# Altium schematic sheet joystick_if.SchDoc: Chorda Fingers
size Tabloid; CheckedBy: artemd@; Author: dnv@; DrawnBy: dnv; Organization: Altium Limited; Address1: 1600 Amphitheatre Pkwy, Mountain View CA 94043; DocumentNumber: N/A; Revision: 1; SheetNumber: 1; SheetTotal: 1
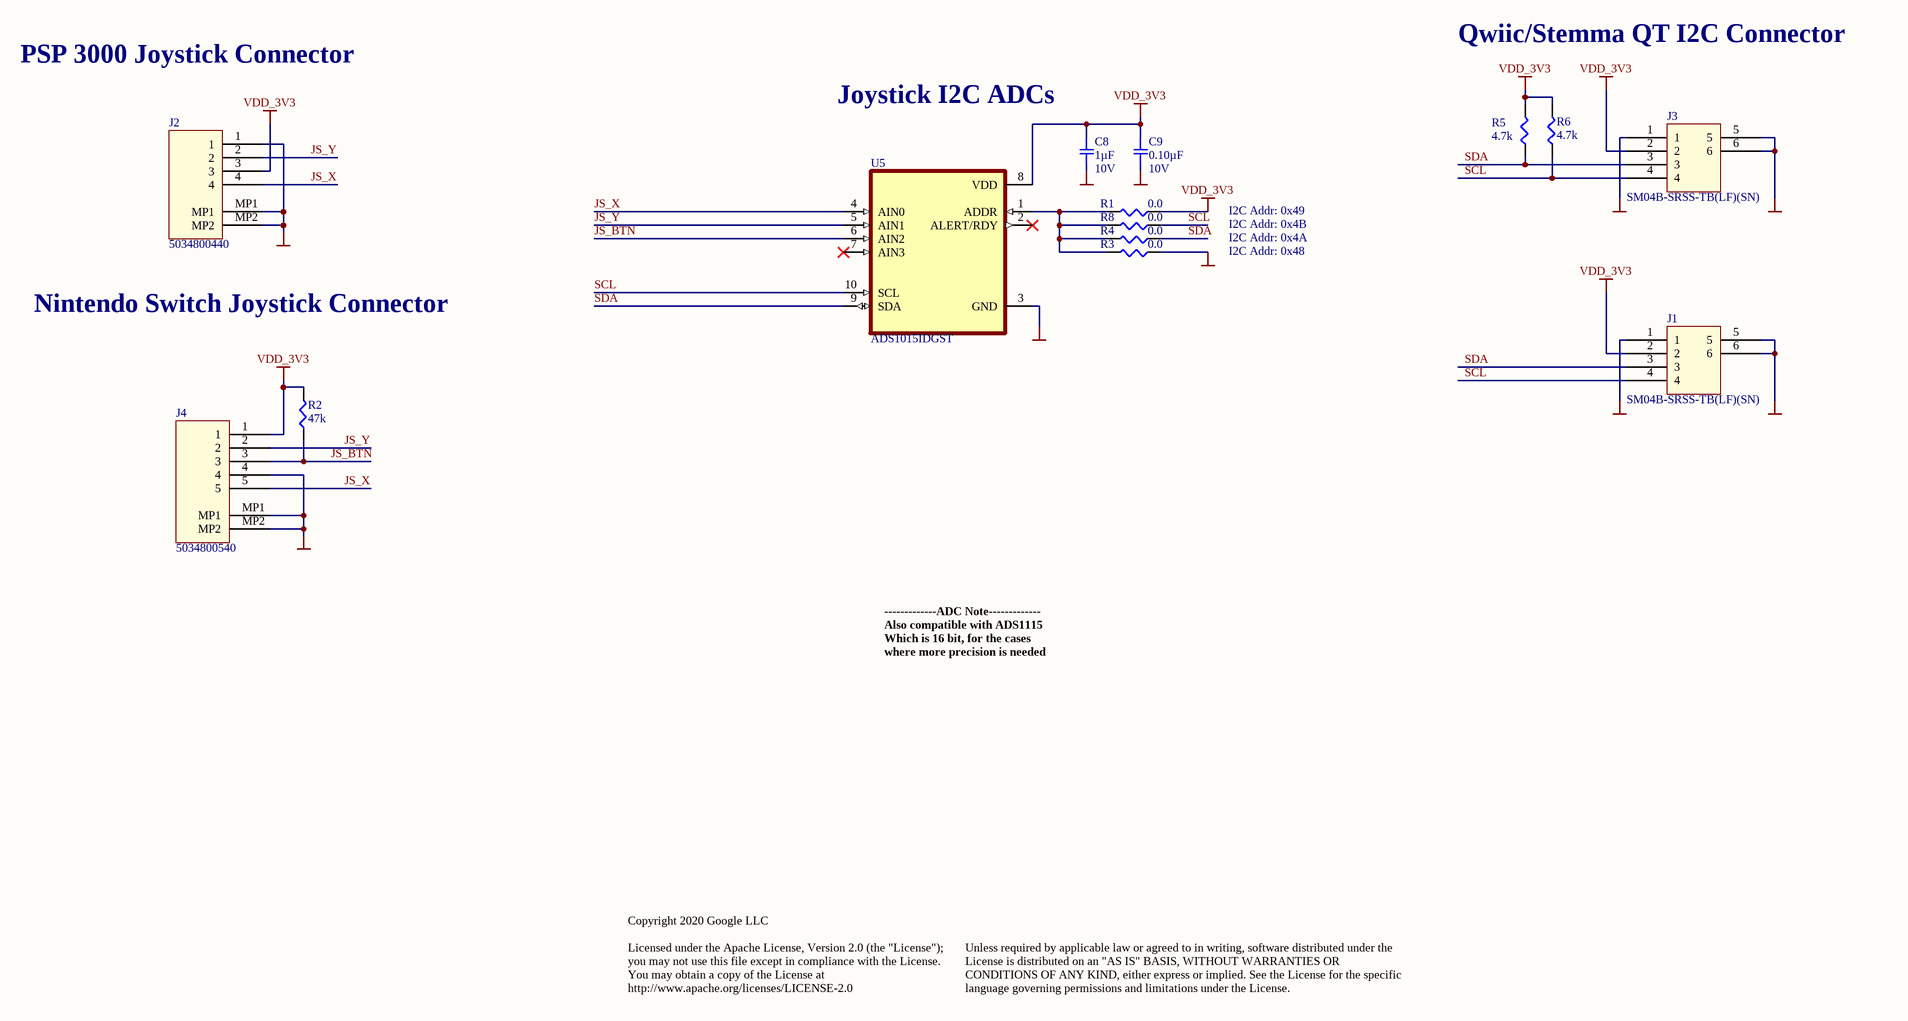
[diagram p0: joystick_if.SchDoc]

## Parts
C8  1µF  Voltage: 10V  [SMD-0402C]
C9  0.10µF  Voltage: 10V  [SMD-0402C]
J1  SM04B-SRSS-TB(LF)(SN)  [4208]
J2  5034800440  [5034800440]
J3  SM04B-SRSS-TB(LF)(SN)  [4208]
J4  5034800540  [5034800540]
R1  0.0  [SMD-0402-RES]
R2  47k  [SMD-0402-RES]
R3  0.0  [SMD-0402-RES]
R4  0.0  [SMD-0402-RES]
R5  4.7k  [SMD-0402-RES]
R6  4.7k  [SMD-0402-RES]
R8  0.0  [SMD-0402-RES]
U5  ADS1015IDGST  [SOP50P490X110-10N]

## Nets
GND: C8.2 C9.2 J1.1 J1.5 J1.6 J2.1 J2.MP1 J2.MP2 J3.1 J3.5 J3.6 J4.4 J4.MP1 J4.MP2 R3.1 U5.3(GND)
VDD_3V3: C8.1 C9.1 J1.2 J2.3 J3.2 J4.1 R1.1 R2.2 R5.2 R6.2 U5.8(VDD)
JS_BTN: J4.3 R2.1 U5.6(AIN2)
JS_X: J2.4 J4.5 U5.4(AIN0)
JS_Y: J2.2 J4.2 U5.5(AIN1)
SCL: J1.4 J3.4 R6.1 R8.1 U5.10(SCL)
SDA: J1.3 J3.3 R4.1 R5.1 U5.9(SDA)
NetR1_2: R1.2 R3.2 R4.2 R8.2 U5.1(ADDR)

Not connected (* = marked no-connect by the designer): U5 2(ALERT/RDY)* 7(AIN3)*

## Notes on the sheet
- Qwiic/Stemma QT I2C Connector
- PSP 3000 Joystick Connector
- (near C8) Joystick I2C ADCs
- I2C Addr: 0x48
- I2C Addr: 0x49
- I2C Addr: 0x4B
- I2C Addr: 0x4A
- Nintendo Switch Joystick Connector
- -------------ADC Note-------------
  Also compatible with ADS1115
  Which is 16 bit, for the cases
  where more precision is needed
- Copyright 2020 Google LLC
  Licensed under the Apache License, Version 2.0 (the "License");
  you may not use this file except in compliance with the License.
  You may obtain a copy of the License at
  http://www.apache.org/licenses/LICENSE-2.0
- Unless required by applicable law or agreed to in writing, software distributed under the License is distributed on an "AS IS" BASIS, WITHOUT WARRANTIES OR CONDITIONS OF ANY KIND, either express or implied. See the License for the specific language governing permissions and limitations under the License.
- GPN:
- Title:
- Revision:
- Size:
- Tabloid
- Author:
- Reviewers:
- Date:
- Time:
- Sheet
- of

## Library data of the parts
C8 = GRM155R61A105KE15D: CAP CER 1UF 10V X5R 0402; Manufacturer: Murata Electronics North America; Factory Stock: 0; Unit Price (USD): 0.1; Minimum Quantity: 1; Tolerance: ±10%; Datasheets: http://www.murata.com/~/media/webrenewal/support/library/catalog/products/capacitor/mlcc/c02e.pdf; Image: //media.digikey.com/Renders/Murata%20Renders/ZRB-SERIES-0402.jpg; Digi-Key Part Number: 490-3890-1-ND; Part Number: GRM155R61A105KE15D; Quantity Available: 6162668; @ qty: 0; Packaging: Cut Tape (CT); Series: GRM; Part Status: Active; Value: 1µF; Temperature Coefficient: X5R; Operating Temperature: -55°C ~ 85°C; Features: -; Ratings: -; Applications: General Purpose; Mounting Type: Surface Mount, MLCC; Package / Case: 0402 (1005 Metric); Size / Dimension: 0.039" L x 0.020" W (1.00mm x 0.50mm); Height - Seated (Max): -; Thickness (Max): 0.022" (0.55mm); Lead Spacing: -; Lead Style: -
C9 = GRM152R61A104KE19D: CAP CER 0.1UF 10V X5R 0402; Manufacturer: Murata Electronics North America; Factory Stock: 0; Unit Price (USD): 0.16; Minimum Quantity: 1; Tolerance: ±10%; Datasheets: http://www.murata.com/~/media/webrenewal/support/library/catalog/products/capacitor/mlcc/c02e.pdf; Image: //media.digikey.com/Renders/Murata%20Renders/ZRB-SERIES-0402.jpg; Digi-Key Part Number: 490-10008-1-ND; Part Number: GRM152R61A104KE19D; Quantity Available: 80241; @ qty: 0; Packaging: Cut Tape (CT); Series: GRM; Part Status: Active; Value: 0.10µF; Temperature Coefficient: X5R; Operating Temperature: -55°C ~ 85°C; Features: Derating Recommended; Ratings: -; Applications: General Purpose; Mounting Type: Surface Mount, MLCC; Package / Case: 0402 (1005 Metric); Size / Dimension: 0.039" L x 0.020" W (1.00mm x 0.50mm); Height - Seated (Max): -; Thickness (Max): 0.009" (0.22mm); Lead Spacing: -; Lead Style: -
J1 J3 = 4208
R1 R3 R4 R8 = ERJ-2GE0R00X: RES SMD 0.0OHM JUMPER 1/10W 0402; Manufacturer: Panasonic Electronic Components; Factory Stock: 0; Unit Price (USD): 0.00384; @ qty: 1500; Minimum Quantity: 1; Power (Watts): 0.1W, 1/10W; Part Number: ERJ-2GE0R00X; Datasheets: http://industrial.panasonic.com/www-cgi/jvcr13pz.cgi?E+PZ+3+AOA0001+ERJ2GE0R00X+7+WW; Image: //media.digikey.com/Photos/Panasonic%20Photos/ERJ-PA2-Series.jpg; Digi-Key Part Number: P0.0JCT-ND; Quantity Available: 3152483; Packaging: Cut Tape (CT); Series: ERJ; Part Status: Active; Value: 0.0; Tolerance: Jumper; Composition: Thick Film; Features: Automotive AEC-Q200; Temperature Coefficient: -; Operating Temperature: -55°C ~ 155°C; Package / Case: 0402 (1005 Metric); Supplier Device Package: 0402; Size / Dimension: 0.039" L x 0.020" W (1.00mm x 0.50mm); Height - Seated (Max): 0.016" (0.40mm); Number of Terminations: 2; Failure Rate: -
R2 = ERJ-2GEJ473X: RES SMD 47K OHM 5% 1/10W 0402; Manufacturer: Panasonic Electronic Components; Factory Stock: 0; Unit Price (USD): 0.00350; @ qty: 1500; Minimum Quantity: 1; Power (Watts): 0.1W, 1/10W; Temperature Coefficient: ±200ppm/°C; Part Number: ERJ-2GEJ473X; Datasheets: http://industrial.panasonic.com/www-cgi/jvcr13pz.cgi?E+PZ+3+AOA0001+ERJ2GEJ473X+7+WW; Image: //media.digikey.com/Photos/Panasonic%20Photos/ERJ-PA2-Series.jpg; Digi-Key Part Number: P47KJCT-ND; Quantity Available: 5182645; Packaging: Cut Tape (CT); Series: ERJ; Part Status: Active; Value: 47k; Tolerance: ±5%; Composition: Thick Film; Features: Automotive AEC-Q200; Operating Temperature: -55°C ~ 155°C; Package / Case: 0402 (1005 Metric); Supplier Device Package: 0402; Size / Dimension: 0.039" L x 0.020" W (1.00mm x 0.50mm); Height - Seated (Max): 0.016" (0.40mm); Number of Terminations: 2; Failure Rate: -
R5 R6 = ERJ-2GEJ472X: RES SMD 4.7K OHM 5% 1/10W 0402; Manufacturer: Panasonic Electronic Components; Factory Stock: 0; Unit Price (USD): 0.00350; @ qty: 1500; Minimum Quantity: 1; Power (Watts): 0.1W, 1/10W; Temperature Coefficient: ±200ppm/°C; Part Number: ERJ-2GEJ472X; Datasheets: http://industrial.panasonic.com/www-cgi/jvcr13pz.cgi?E+PZ+3+AOA0001+ERJ2GEJ472X+7+WW; Image: //media.digikey.com/Photos/Panasonic%20Photos/ERJ-PA2-Series.jpg; Digi-Key Part Number: P4.7KJCT-ND; Quantity Available: 8551774; Packaging: Cut Tape (CT); Series: ERJ; Part Status: Active; Value: 4.7k; Tolerance: ±5%; Composition: Thick Film; Features: Automotive AEC-Q200; Operating Temperature: -55°C ~ 155°C; Package / Case: 0402 (1005 Metric); Supplier Device Package: 0402; Size / Dimension: 0.039" L x 0.020" W (1.00mm x 0.50mm); Height - Seated (Max): 0.016" (0.40mm); Number of Terminations: 2; Failure Rate: -
U5 = ADS1015IDGST: 12-Bit, 3.3kSPS, 4-Ch Delta-Sigma ADC With PGA, Oscillator, VREF, Comparator and I2C Interface 10-VSSOP -40 to 125; MF: Texas Instruments; Mouser-Purchase-URL: https://snapeda.com/shop?store=Mouser&id=425936; Price: None; Availability: Good; Package: VSSOP-10 Texas Instruments; DigiKey-Purchase-URL: https://snapeda.com/shop?store=DigiKey&id=425936; MP: ADS1015IDGST; Value: *; SnapEDA_Link: https://www.snapeda.com/parts/ADS1015IDGST/Texas%20Instruments/view-part/425936/?ref=snap; Texas_Instruments-Purchase-URL: https://snapeda.com/shop?store=Texas+Instruments&id=425936